# EAGLE design I2C-LCD-Backpack (EAGLE 9.5.2)
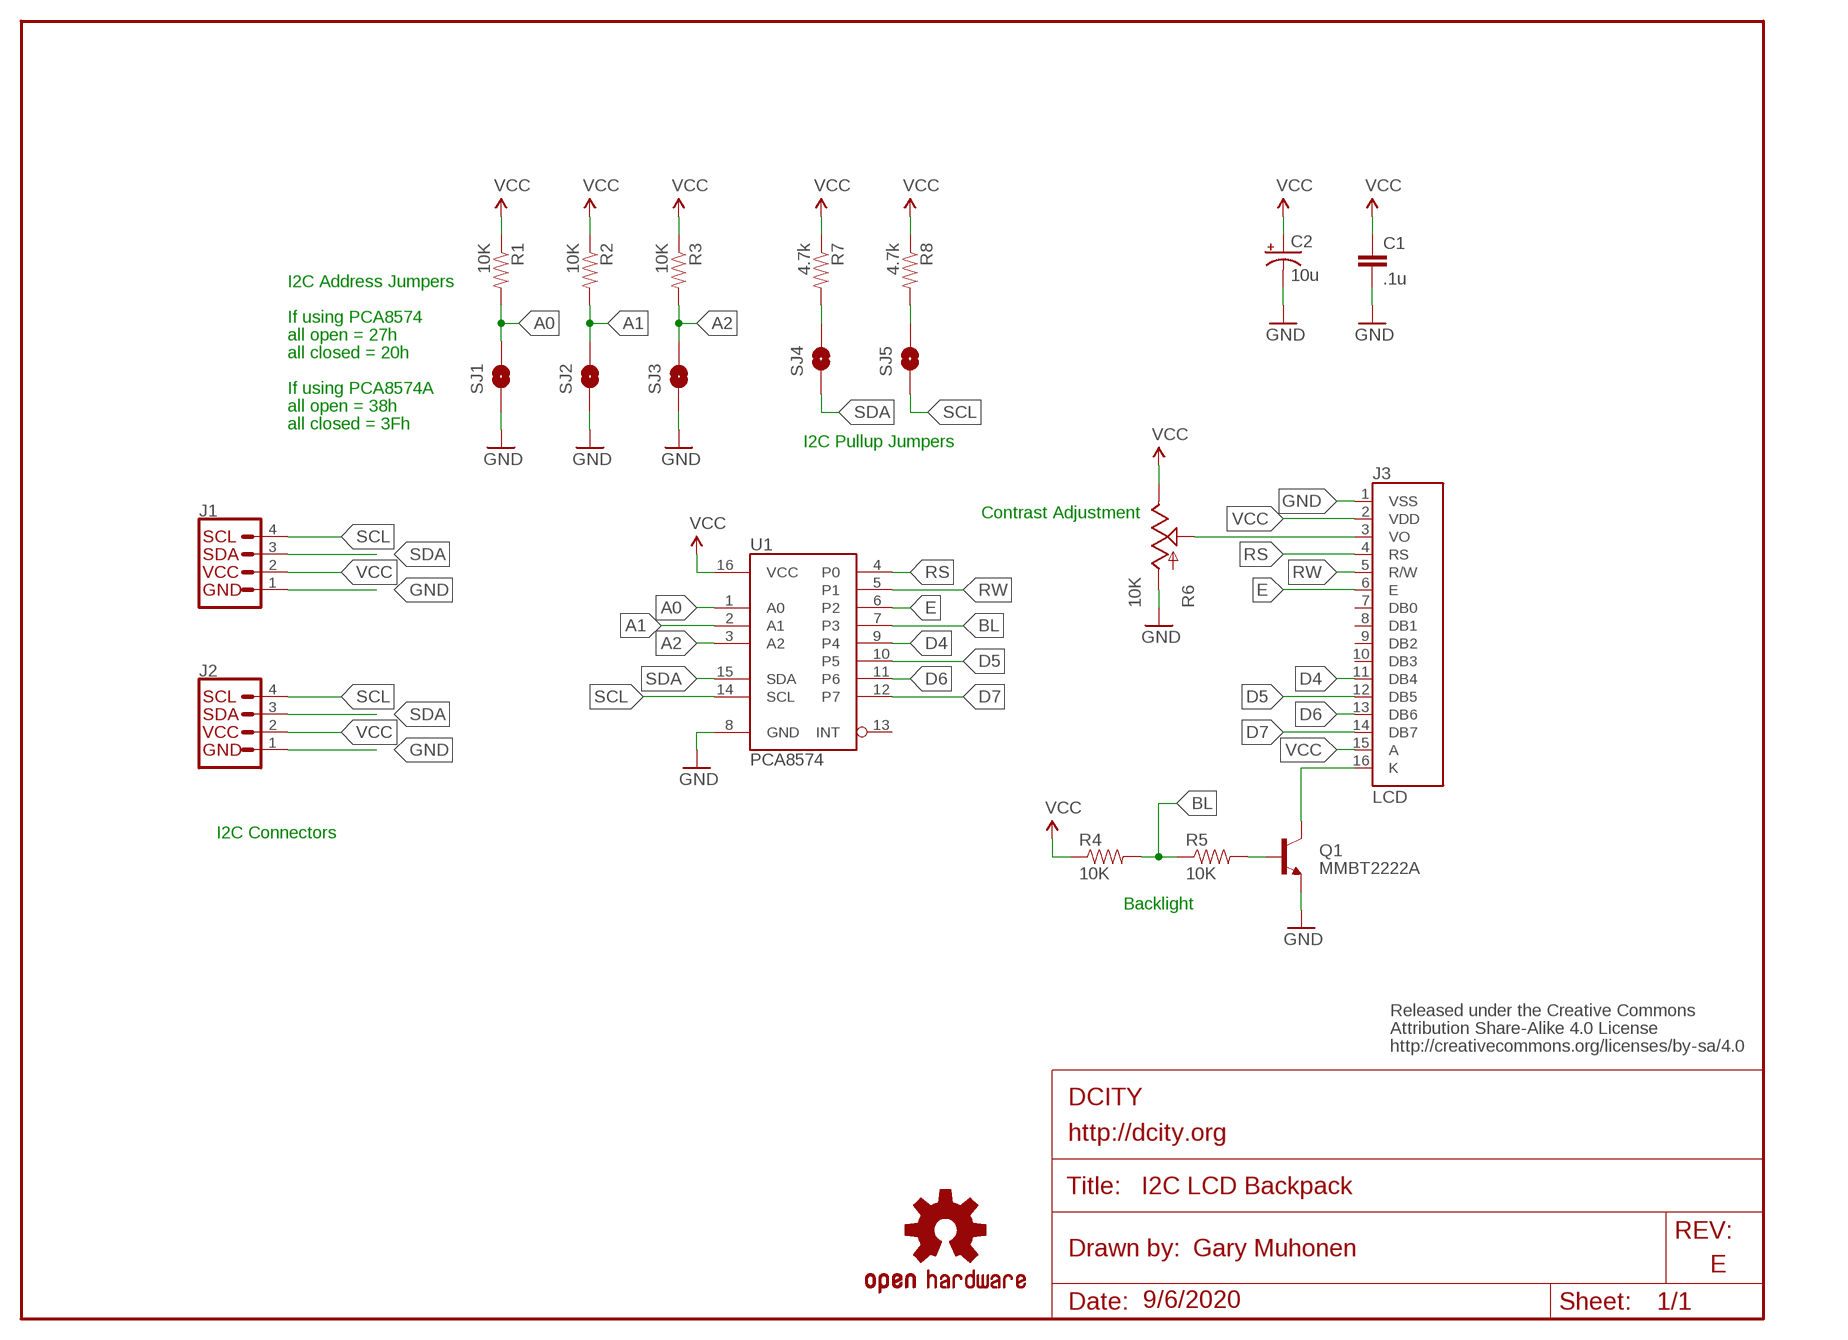
[diagram p0: schematic, sheet 1]
U$1 (DOCFIELD-WHT): COMPANYNAME: DCITY; COMPANYWEBSITE: http://dcity.org; DATE: 9/6/2020; DRAWNBY: Gary Muhonen; TITLE: I2C LCD Backpack; VERSION: E

## Parts
C1  .1u  CAP0805  [0805-CAP]
C2  10u  CAP_POL0805  [0805-POL]
J1  QWIIC_RIGHT_ANGLE  QWIIC_CONNECTORJS-1MM  [JST04_1MM_RA]
J2  QWIIC_RIGHT_ANGLE  QWIIC_CONNECTORJS-1MM  [JST04_1MM_RA]
J3  LCD  LCD-16X2LOCK  [1X16_LOCK]
LOGO1  OSHW-LOGOS  [OSHW-LOGO-S]
Q1  MMBT2222A  TRANSISTOR_NPNMMBT2222A  [SOT23-3]
R1  10K  RESISTOR0805  [0805-RES]
R2  10K  RESISTOR0805  [0805-RES]
R3  10K  RESISTOR0805  [0805-RES]
R4  10K  RESISTOR0805  [0805-RES]
R5  10K  RESISTOR0805  [0805-RES]
R6  10K  10K_LINEAR_POT_SMD  [TC33X]
R7  4.7k  RESISTOR0805  [0805-RES]
R8  4.7k  RESISTOR0805  [0805-RES]
SJ1  SOLDERJUMPERNC  [SJ_2S]
SJ2  SOLDERJUMPERNC  [SJ_2S]
SJ3  SOLDERJUMPERNC  [SJ_2S]
SJ4  SOLDERJUMPERNC  [SJ_2S]
SJ5  SOLDERJUMPERNC  [SJ_2S]
U1  PCA8574  [TSSOP16]
U$2  CREATIVE_COMMONS  [CREATIVE_COMMONS]

## Nets
A0: R1.2 SJ1.2 U1.1(A0)
A1: R2.2 SJ2.2 U1.2(A1)
A2: R3.2 SJ3.2 U1.3(A2)
BL: R4.2 R5.1 U1.7(P3)
D4: J3.11(DB4) U1.9(P4)
D5: J3.12(DB5) U1.10(P5)
D6: J3.13(DB6) U1.11(P6)
D7: J3.14(DB7) U1.12(P7)
E: J3.6(E) U1.6(P2)
GND: C1.2 C2.- J1.1 J2.1 J3.1(VSS) Q1.2(E) R6.1(A) SJ1.1 SJ2.1 SJ3.1 U1.8(GND)
N$1: R7.2 SJ4.2
N$2: R8.2 SJ5.2
N$4: Q1.1(B) R5.2
N$5: J3.16(K) Q1.3(C)
N$8: J3.3(VO) R6.2(S)
RS: J3.4(RS) U1.4(P0)
RW: J3.5(R/W) U1.5(P1)
SCL: J1.4 J2.4 SJ5.1 U1.14(SCL)
SDA: J1.3 J2.3 SJ4.1 U1.15(SDA)
VCC: C1.1 C2.+ J1.2 J2.2 J3.2(VDD) J3.15(A) R1.1 R2.1 R3.1 R4.1 R6.3(E) R7.1 R8.1 U1.16(VCC)
Unconnected: J3.7(DB0) J3.8(DB1) J3.9(DB2) J3.10(DB3) U1.13(INT)

## Notes on the sheet
- I2C Address Jumpers
- If using PCA8574
- all open = 27h
- all closed = 20h
- If using PCA8574A
- all open = 38h
- all closed = 3Fh
- I2C Pullup Jumpers
- Contrast Adjustment
- I2C Connectors
- Backlight

## Library data of the parts
C1 = 0:CAP: Capacitor Standard 0603 ceramic capacitor, and 0.1" leaded capacitor.
C2 = 0:CAP_POL: Capacitor Polarized These are standard SMD and PTH capacitors. Normally 10uF, 47uF, and 100uF in electrolytic and tantalum varieties. Always verify the external diameter of the through hole cap, it varies with capacity, voltage, and manufacturer. The EIA devices should be standard.
J1 J2 = 0:QWIIC_CONNECTOR: SparkFun I2C Standard Qwiic Connector An SMD 1mm pitch JST connector makes it easy and quick (get it? Qwiic?) to connect I2C devices to each other. The Qwiic system <http://www.sparkfun.com/qwiic> enables fast and solderless connection between popular platforms and various sensors and actuators. We carry 200mm <https://www.sparkfun.com/products/14204>, 100mm <https://www.sparkfun.com/products/14205>, 50mm <https://www.sparkfun.com/products/14206>, and breadboard friendly <https://www.sparkfun.com/products/14207> Qwiic cables. We also offer 10 pcs strips <https://www.sparkfun.com/products/14323> the SMD connectors.; PROD_ID: CONN-13694
J3 = 0:LCD-16X2: Standard text-only 16x2 parallel input LCD
LOGO1 = 0:OSHW-LOGO: Open Source Hardware Logo This logo indicates the piece of hardware it is found on incorporates a OSHW license and/or adheres to the definition of open source hardware found here: http://freedomdefined.org/OSHW
Q1 = 0:TRANSISTOR_NPN: Generic NPN BJT MMBT2222A - TRANS-08049 (SOT-23, 1A 40V) MPSA42 - TRANS-09116 (SOT-23, 500mA 300V) MMBT5088LT1G - TRANS-11160 (SOT-23, 50 mA 30V) BC547 - COM-08928 <http://www.sparkfun.com/products/8928> (TO-92 45V 100mA) (1.Collector 2.Base 3.Emitter) 2N3904 - COM-00521 <http://www.sparkfun.com/products/521> (TO-92 40V 200mA) (1.Emitter 2.Base 3.Collector) P2N2222A - COM-12852 <http://www.sparkfun.com/products/12852> (TO-92 40V 600mA) (1.Collector 2.Base 3.Emitter); PROD_ID: TRANS-08049
R1-R5 R7 R8 = 0:RESISTOR: Resistor Basic schematic elements and footprints for 0603, 1206, and PTH 1/10th watt (small) resistors.
R6 = 0:10K_LINEAR_POT_SMD; PROD_ID: RES-12428
SJ1-SJ5 = 0:SOLDERJUMPER: Solder Jumper Standard SMD solder jumper. Used to automate production. Two varients : Normally Open and Normally Closed are the same, but have different paste layers. NC will have a large amount of paste and should jumper during reflow.
U1 = 0:PCA8574
U$2 = 0:CREATIVE_COMMONS

## Board
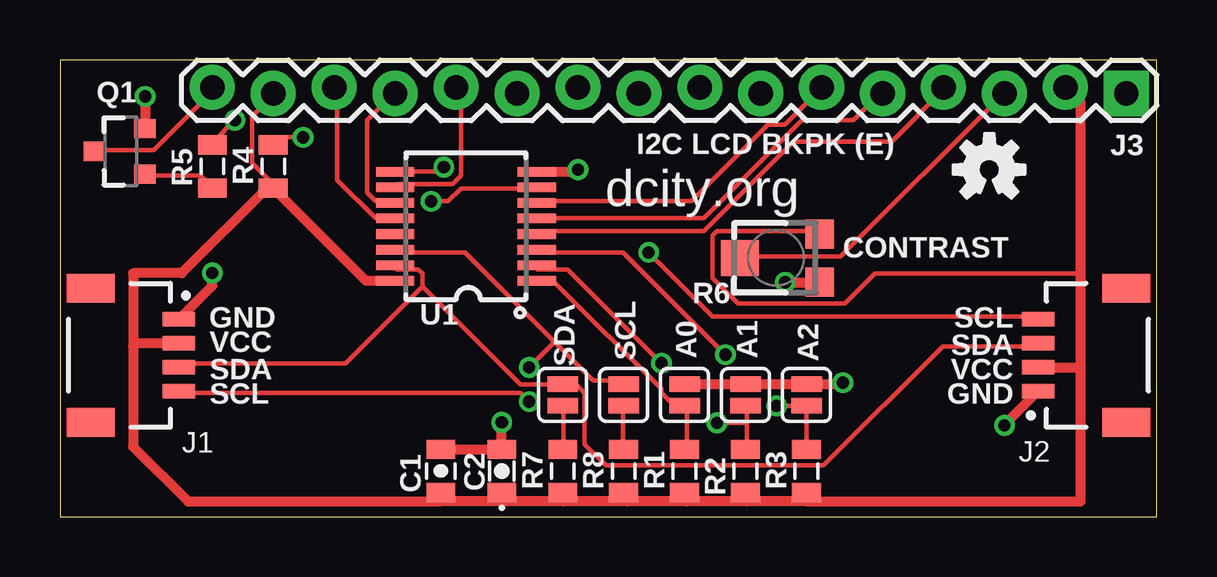
[diagram p1: board, top side]
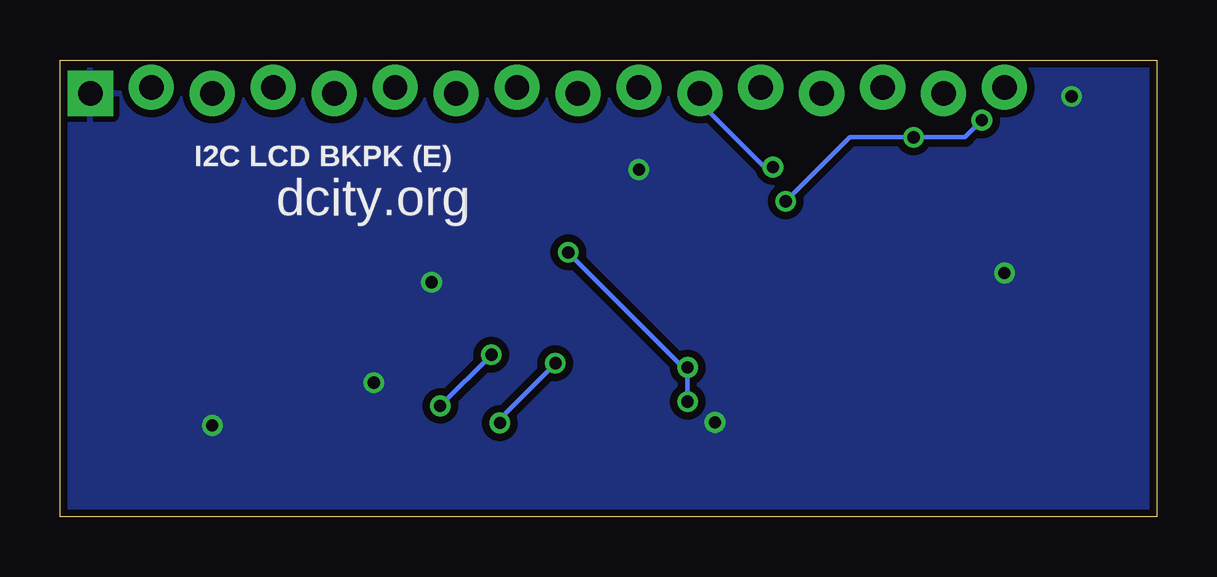
[diagram p2: board, bottom side, seen from below]

Size 45.72 x 19.05 mm. Coordinates in mm from the lower left corner, seen from the top.
Outline: 0,0 45.72,0 45.72,19.05 0,19.05 0,0
Copper layers (1*16): Top 0.035mm / dielectric 1.5mm / Bottom 0.035mm
Design rules "7mils-gary": minimum track width 7mil, minimum drill 20mil, track to track 7mil, track to pad 7mil, pad to pad 7mil, via to via 7mil, smd to smd 7mil, copper to edge 7mil, drill to drill 7mil, minimum pad ring 7mil, minimum via ring 7mil, stop-mask expansion 4mil, vias tented up to drill 25mil, thermal gap 10mil
vRestrict: area 4.6,13.6 to 5.6,15.4; area 7.1,13.7 to 8.1,15.4; area 14.7,7.7 to 16.6,8.9; area 18.8,8.1 to 19.6,8.9; area 20.4,6.3 to 21.6,8.9; area 23,6.5 to 24.1,8.9; area 25.5,6.5 to 26.7,8.3; area 28.2,6.5 to 29.3,8.1; area 30.7,6.3 to 31.9,8.1; area 14,0.9 to 15.2,2.7; area 16.6,0.9 to 17.8,2.5; area 19.2,0.9 to 20.3,2.8; 4 more areas

### Footprints (pad centres in the part's own frame; a part is rotated, then mirrored left to right if it is on the bottom)
0805-CAP = smd 0.8 x 1.2: 1 -0.9,0; 2 0.9,0
0805-POL = smd 0.8 x 1.2: + 0.9,0; - -0.9,0
JST04_1MM_RA = smd 0.6 x 1.35: 1 -1.5,0; 2 -0.5,0; 3 0.5,0; 4 1.5,0 | smd 1.2 x 2: NC1 2.8,-3.675; NC2 -2.8,-3.675
1X16_LOCK = drill 1.016 pad 1.88 square: 1 0,0.127 | drill 1.016 pad 1.88: 2 2.54,-0.127; 3 5.08,0.127; 4 7.62,-0.127; 5 10.16,0.127; 6 12.7,-0.127; 7 15.24,0.127; 8 17.78,-0.127; 9 20.32,0.127; 10 22.86,-0.127; 11 25.4,0.127; 12 27.94,-0.127; 13 30.48,0.127; 14 33.02,-0.127; 15 35.56,0.127; 16 38.1,-0.127
SOT23-3 = smd 0.8 x 0.9: 1 -0.95,-1; 2 0.95,-1; 3 0,1.1
0805-RES = smd 0.8 x 1.2: 1 -0.9,0; 2 0.9,0
TC33X = smd 1.2 x 1.2: 1 -1,-1.825; 3 1,-1.825 | smd 1.5 x 1.6: 2 0,1.5
SJ_2S = smd 0.635 x 1.27: 1 -0.45,0; 2 0.45,0
TSSOP16 = smd 0.4 x 1.6: 1 -2.225,-2.85; 2 -1.575,-2.85; 3 -0.925,-2.85; 4 -0.275,-2.85; 5 0.375,-2.85; 6 1.025,-2.85; 7 1.675,-2.85; 8 2.325,-2.85; 9 2.325,3.05; 10 1.675,3.05; 11 1.025,3.05; 12 0.375,3.05; 13 -0.275,3.05; 14 -0.925,3.05; 15 -1.575,3.05; 16 -2.225,3.05

### Placement (x,y rotation side)
C1  15.88,1.91 90 top
C2  18.41,1.91 270 top
J1  4.95,6.73 270 top
J2  40.77,6.73 90 top
J3  44.45,17.78 180 top
LOGO1  38.73,14.48 0 top
Q1  2.54,15.24 90 top
R1  26.04,1.91 90 top
R2  28.57,1.91 90 top
R3  31.11,1.91 90 top
R4  8.89,14.61 90 top
R5  6.35,14.61 270 top
R6  29.84,10.79 90 top
R7  20.95,1.91 90 top
R8  23.5,1.91 90 top
SJ1  26.04,5.08 270 top
SJ2  28.57,5.08 270 top
SJ3  31.11,5.08 270 top
SJ4  20.95,5.08 270 top
SJ5  23.5,5.08 270 top
U1  17.02,12.06 90 top
U$2  1.27,20.32 0 top

### Tracks (layer width: path | path; a pad name or v marks a point on that pad's centre or on a via)
A0
  Top 0.178: R1.2 26.14,2.85 26.14,4.62 SJ1.2 25.96,4.8 25.43,4.8 25.07,5.16 25.07,5.33 20.62,9.78 19.91,9.78 U1.1
A1  (via drill 0.51)
  Top 0.178: 28.63,3.91 28.63,4.62 SJ2.2 | 28.63,3.91 28.63,2.85 R2.2 | v25.07,6.4 21.16,10.31 19.91,10.31 U1.2 | 28.63,3.91 v27.38,3.91
  Bottom 0.178: v25.07,6.4 27.38,4.09 v27.38,3.91
A2  (via drill 0.51)
  Top 0.178: SJ3.2 R3.2 | v27.74,6.76 23.47,11.02 19.91,11.02 U1.3 | SJ3.2 v29.87,4.62 | SJ3.2
  Bottom 0.178: v29.87,4.62 v27.74,6.76
BL  (via drill 0.51)
  Top 0.178: v7.29,16.54 6.4,15.65 R5.1 | v10.13,15.82 9.07,15.82 8.89,15.65 R4.2 | v15.47,13.16 16.18,13.16 16.71,13.69 19.74,13.69 U1.7
  Bottom 0.178: v7.29,16.54 8,15.82 v10.13,15.82 12.8,15.82 v15.47,13.16
D4  (via drill 0.51)
  Top 0.178: v16,14.58 15.82,14.4 14.05,14.4 U1.9
  Bottom 0.178: v16,14.58 16.36,14.58 19.02,17.25 19.02,17.6 J3.11
D5
  Top 0.178: U1.10 14.05,13.87 16.36,13.87 16.71,14.22 16.71,17.6 16.54,17.78 J3.12
D6
  Top 0.178: U1.11 13.87,13.16 13.16,13.16 12.8,13.51 12.8,16.54 13.87,17.6 J3.13
D7
  Top 0.178: U1.12 13.87,12.45 13.16,12.45 11.56,14.05 11.56,17.78 J3.14
E
  Top 0.178: U1.6 19.91,13.16 26.31,13.16 29.52,16.36 30.23,16.36 31.65,17.78 J3.6
GND  (via drill 0.51)
  Top 0.406: v3.56,17.53 3.56,16.21 Q1.2 | U1.8 21.5,14.39 v21.59,14.48 | C1.2 C2.- v18.41,3.94 | v30.23,9.78 31.65,9.78 R6.1 | SJ1.1 SJ2.1 SJ3.1 32.58,5.53 v32.64,5.59 | J2.1 39.37,3.83 v39.37,3.81 | J1.1 6.35,9.63 v6.35,10.16
  pour Bottom (isolate 0.305): 0,19.05 45.72,19.05 45.72,0 0,0
N$1
  Top 0.178: R7.2 20.98,2.85 20.98,4.62 SJ4.2
N$2
  Top 0.178: R8.2 23.47,2.85 23.47,4.62 SJ5.2
N$4
  Top 0.178: Q1.1 3.56,14.22 5.87,14.22 6.22,13.87 R5.2
N$5
  Top 0.178: Q1.3 1.6,15.29 3.91,15.29 6.4,17.78 J3.16
N$8
  Top 0.178: R6.2 28.45,10.85 32.54,10.85 39.29,17.6 J3.3
RS
  Top 0.178: U1.4 19.91,11.91 26.85,11.91 30.58,15.65 34.67,15.65 36.8,17.78 J3.4
RW
  Top 0.178: U1.5 19.91,12.45 26.85,12.45 30.94,16.54 33.07,16.54 34.14,17.6 J3.5
SCL  (via drill 0.51)
  Top 0.178: 20.62,7.29 16.89,11.02 14.05,11.02 U1.14 | 20.62,7.29 22.23,5.69 23.47,5.69 SJ5.1 | v19.56,6.22 20.62,7.29 | v19.56,4.8 19.2,5.16 4.98,5.16 J1.4 | v24.54,11.02 27.2,8.36 40.72,8.36 J2.4
  Bottom 0.178: v19.56,4.8 19.56,6.04 | 19.56,6.04 v24.54,11.02 | 19.56,6.04 v19.56,6.22
SDA
  Top 0.178: 15.11,9.6 19.2,5.51 20.8,5.51 SJ4.1 | 15.11,9.6 15.11,10.13 14.94,10.31 14.05,10.31 U1.15 | 21.51,5.51 20.98,5.51 SJ4.1 | 15.11,9.6 11.91,6.4 4.98,6.4 J1.3 | 21.51,5.51 21.87,5.16 21.87,3.02 22.76,2.13 31.83,2.13 36.8,7.11 40.72,7.11 J2.3 | 21.51,5.51 SJ4.1
VCC
  Top 0.178: J3.15 8.89,17.6 8,16.71 8,14.76 8.89,13.87 R4.1 8.89,13.69 | 15.82,0.64 15.82,0.89 C1.1 | 23.65,0.64 23.65,0.89 R8.1 | 18.49,0.64 18.49,0.89 C2.+ | 20.98,0.64 20.98,0.89 R7.1 | 26.14,0.64 26.14,0.89 R1.1 | 28.63,0.64 28.63,0.89 R2.1 | 31.11,0.64 R3.1 | R6.3 31.65,11.91 27.38,11.91 27.2,11.73 27.2,9.96 28.27,8.89 32.72,8.89 33.96,10.13 42.52,10.13 42.55,10.16
  Top 0.406: 8.89,13.69 8.61,13.69 5.08,10.16 3.05,10.16 3.05,7.11 | J3.2 42.55,17.27 42.55,10.16 42.55,7.24 | 42.55,6.22 42.55,0.64 31.11,0.64 28.63,0.64 26.14,0.64 23.65,0.64 20.98,0.64 18.49,0.64 15.82,0.64 5.33,0.64 3.05,2.92 3.05,7.11 | 42.55,6.22 42.55,7.24 | 42.54,7.23 42.55,7.24 | U1.16 12.76,9.84 R4.1 | J1.2 3.17,7.23 3.05,7.11 | J2.2 42.54,6.23 42.55,6.22

### Text on the board
tPlace: Q1 | I2C LCD BKPK (E) | dcity.org | CONTRAST | SDA | SCL | SCL | GND | SDA | VCC | A0 | A1 | VCC | SDA | A2 | GND | SCL
bPlace: I2C LCD BKPK (E) | dcity.org